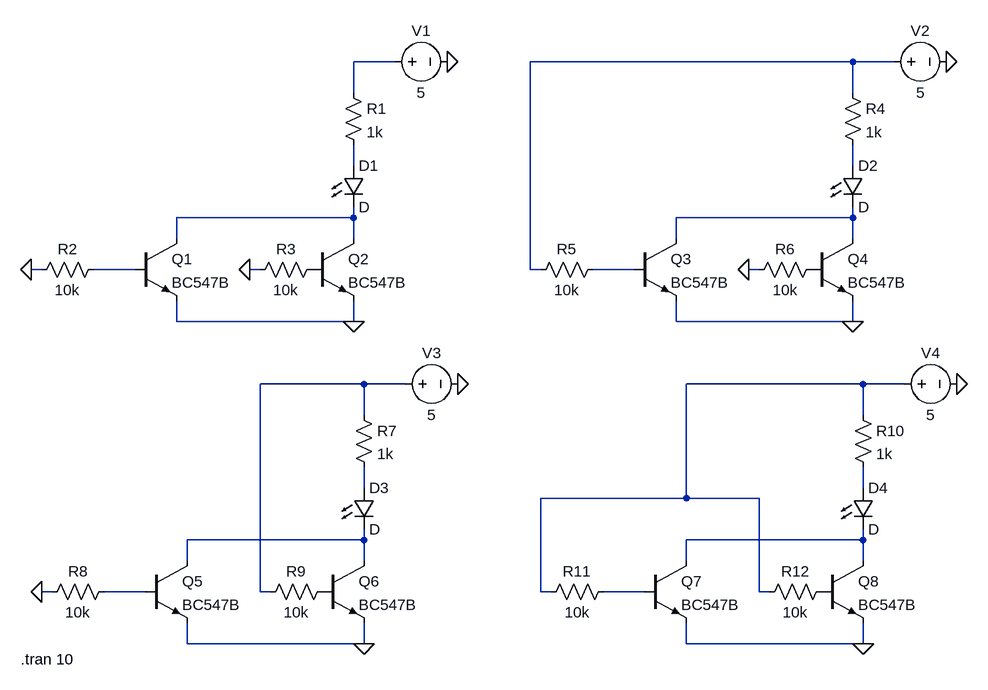
[diagram p0: schematic NorGte.asc]
NorGte.asc, the LTspice schematic file:
Version 4.1
SHEET 1 1348 776
WIRE 464 -160 400 -160
WIRE 1168 -160 672 -160
WIRE 1232 -160 1168 -160
WIRE 400 -112 400 -160
WIRE 1168 -112 1168 -160
WIRE 400 0 400 -32
WIRE 1168 0 1168 -32
WIRE 400 80 400 64
WIRE 400 80 128 80
WIRE 1168 80 1168 64
WIRE 1168 80 896 80
WIRE 128 112 128 80
WIRE 400 112 400 80
WIRE 896 112 896 80
WIRE 1168 112 1168 80
WIRE -80 160 -96 160
WIRE 64 160 0 160
WIRE 256 160 240 160
WIRE 672 160 672 -160
WIRE 688 160 672 160
WIRE 832 160 768 160
WIRE 1024 160 1008 160
WIRE 128 240 128 208
WIRE 400 240 400 208
WIRE 400 240 128 240
WIRE 896 240 896 208
WIRE 1168 240 1168 208
WIRE 1168 240 896 240
WIRE 416 336 256 336
WIRE 480 336 416 336
WIRE 1184 336 912 336
WIRE 1248 336 1184 336
WIRE 416 384 416 336
WIRE 1184 384 1184 336
WIRE 416 496 416 464
WIRE 1184 496 1184 464
WIRE 912 512 912 336
WIRE 912 512 688 512
WIRE 1024 512 912 512
WIRE 416 576 416 560
WIRE 416 576 144 576
WIRE 1184 576 1184 560
WIRE 1184 576 912 576
WIRE 144 608 144 576
WIRE 416 608 416 576
WIRE 912 608 912 576
WIRE 1184 608 1184 576
WIRE -64 656 -80 656
WIRE 80 656 16 656
WIRE 256 656 256 336
WIRE 272 656 256 656
WIRE 688 656 688 512
WIRE 704 656 688 656
WIRE 848 656 784 656
WIRE 1024 656 1024 512
WIRE 1040 656 1024 656
WIRE 144 736 144 704
WIRE 416 736 416 704
WIRE 416 736 144 736
WIRE 912 736 912 704
WIRE 1184 736 1184 704
WIRE 1184 736 912 736
FLAG 400 240 0
FLAG 544 -160 0
FLAG 240 160 0
FLAG -96 160 0
FLAG 1168 240 0
FLAG 1312 -160 0
FLAG 1008 160 0
FLAG 416 736 0
FLAG 560 336 0
FLAG -80 656 0
FLAG 1184 736 0
FLAG 1328 336 0
SYMBOL npn 64 112 R0
SYMATTR InstName Q1
SYMATTR Value BC547B
SYMBOL npn 336 112 R0
SYMATTR InstName Q2
SYMATTR Value BC547B
SYMBOL LED 384 0 R0
SYMATTR InstName D1
SYMBOL res 384 -128 R0
SYMATTR InstName R1
SYMATTR Value 1k
SYMBOL res 16 144 R90
WINDOW 0 0 56 VBottom 2
WINDOW 3 32 56 VTop 2
SYMATTR InstName R2
SYMATTR Value 10k
SYMBOL voltage 448 -160 R270
WINDOW 0 32 56 VTop 2
WINDOW 3 -32 56 VBottom 2
WINDOW 123 0 0 Left 0
WINDOW 39 0 0 Left 0
SYMATTR InstName V1
SYMATTR Value 5
SYMBOL res 352 144 R90
WINDOW 0 0 56 VBottom 2
WINDOW 3 32 56 VTop 2
SYMATTR InstName R3
SYMATTR Value 10k
SYMBOL npn 832 112 R0
SYMATTR InstName Q3
SYMATTR Value BC547B
SYMBOL npn 1104 112 R0
SYMATTR InstName Q4
SYMATTR Value BC547B
SYMBOL LED 1152 0 R0
SYMATTR InstName D2
SYMBOL res 1152 -128 R0
SYMATTR InstName R4
SYMATTR Value 1k
SYMBOL res 784 144 R90
WINDOW 0 0 56 VBottom 2
WINDOW 3 32 56 VTop 2
SYMATTR InstName R5
SYMATTR Value 10k
SYMBOL voltage 1216 -160 R270
WINDOW 0 32 56 VTop 2
WINDOW 3 -32 56 VBottom 2
WINDOW 123 0 0 Left 0
WINDOW 39 0 0 Left 0
SYMATTR InstName V2
SYMATTR Value 5
SYMBOL res 1120 144 R90
WINDOW 0 0 56 VBottom 2
WINDOW 3 32 56 VTop 2
SYMATTR InstName R6
SYMATTR Value 10k
SYMBOL npn 80 608 R0
SYMATTR InstName Q5
SYMATTR Value BC547B
SYMBOL npn 352 608 R0
SYMATTR InstName Q6
SYMATTR Value BC547B
SYMBOL LED 400 496 R0
SYMATTR InstName D3
SYMBOL res 400 368 R0
SYMATTR InstName R7
SYMATTR Value 1k
SYMBOL res 32 640 R90
WINDOW 0 0 56 VBottom 2
WINDOW 3 32 56 VTop 2
SYMATTR InstName R8
SYMATTR Value 10k
SYMBOL voltage 464 336 R270
WINDOW 0 32 56 VTop 2
WINDOW 3 -32 56 VBottom 2
WINDOW 123 0 0 Left 0
WINDOW 39 0 0 Left 0
SYMATTR InstName V3
SYMATTR Value 5
SYMBOL res 368 640 R90
WINDOW 0 0 56 VBottom 2
WINDOW 3 32 56 VTop 2
SYMATTR InstName R9
SYMATTR Value 10k
SYMBOL npn 848 608 R0
SYMATTR InstName Q7
SYMATTR Value BC547B
SYMBOL npn 1120 608 R0
SYMATTR InstName Q8
SYMATTR Value BC547B
SYMBOL LED 1168 496 R0
SYMATTR InstName D4
SYMBOL res 1168 368 R0
SYMATTR InstName R10
SYMATTR Value 1k
SYMBOL res 800 640 R90
WINDOW 0 0 56 VBottom 2
WINDOW 3 32 56 VTop 2
SYMATTR InstName R11
SYMATTR Value 10k
SYMBOL voltage 1232 336 R270
WINDOW 0 32 56 VTop 2
WINDOW 3 -32 56 VBottom 2
WINDOW 123 0 0 Left 0
WINDOW 39 0 0 Left 0
SYMATTR InstName V4
SYMATTR Value 5
SYMBOL res 1136 640 R90
WINDOW 0 0 56 VBottom 2
WINDOW 3 32 56 VTop 2
SYMATTR InstName R12
SYMATTR Value 10k
TEXT -112 760 Left 2 !.tran 10

The netlist it stands for:
* NorGte.asc
Q1 N005 N007 0 0 BC547B
Q2 N005 P001 0 0 BC547B
D1 N003 N005 D
R1 N001 N003 1k
R2 N007 0 10k
V1 N001 0 5
R3 P001 0 10k
Q3 N006 N008 0 0 BC547B
Q4 N006 P002 0 0 BC547B
D2 N004 N006 D
R4 N002 N004 1k
R5 N008 N002 10k
V2 N002 0 5
R6 P002 0 10k
Q5 N013 N015 0 0 BC547B
Q6 N013 P003 0 0 BC547B
D3 N011 N013 D
R7 N009 N011 1k
R8 N015 0 10k
V3 N009 0 5
R9 P003 N009 10k
Q7 N014 N016 0 0 BC547B
Q8 N014 P004 0 0 BC547B
D4 N012 N014 D
R10 N010 N012 1k
R11 N016 N010 10k
V4 N010 0 5
R12 P004 N010 10k
.model D D
.lib standard.dio
.model NPN NPN
.model PNP PNP
.lib standard.bjt
.tran 10
.backanno
.end